# Altium schematic sheet USB Circuit.SchDoc
size A4
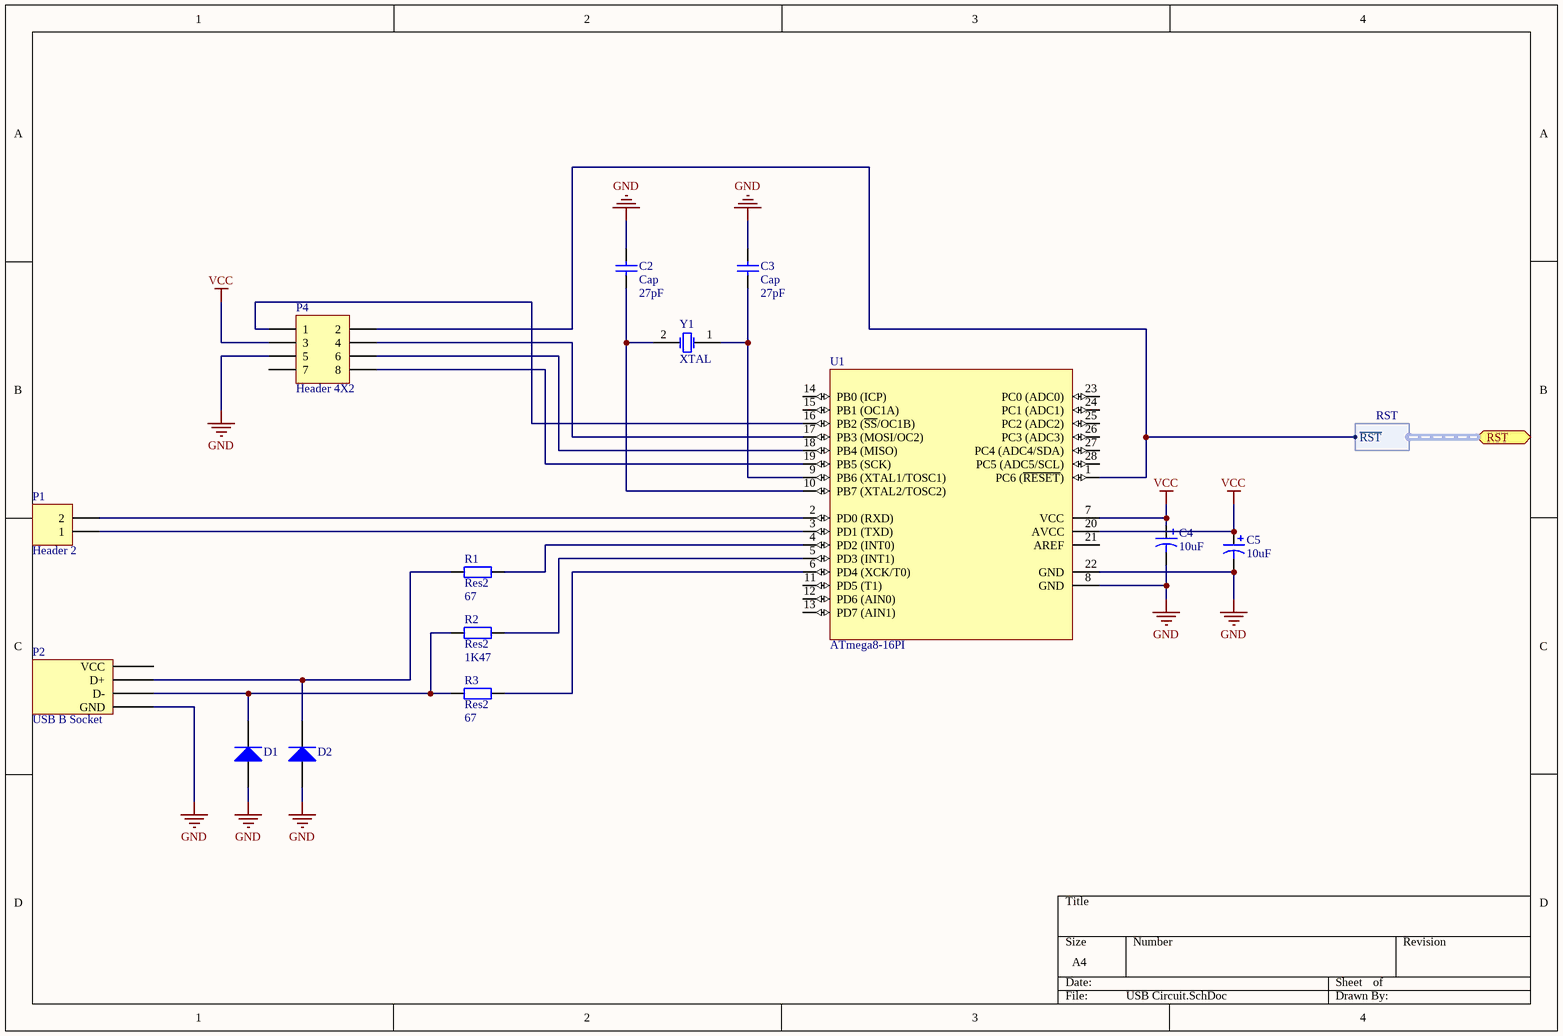
[diagram p0: USB Circuit.SchDoc]

## Parts
C2  Cap  value 27pF  [CAPR2.54-5.1x3.2]
C3  Cap  value 27pF  [CAPR2.54-5.1x3.2]
C4  value 10uF  [CAPPR1.5-4x5]  (hidden comment: Cap Pol1)
C5  value 10uF  [CAPPR1.5-4x5]  (hidden comment: Cap Pol1)
D1  BZX79-C3V6  [SOD27]  (value not drawn)
D2  BZX79-C3V6  [SOD27]  (value not drawn)
P1  Header 2  [HDR1X2]
P2  USB B Socket  [USB B Socket]
P4  Header 4X2  [HDR2X4]
R1  Res2  value 67  [AXIAL-0.4]
R2  Res2  value 1K47  [AXIAL-0.4]
R3  Res2  value 67  [AXIAL-0.4]
U1  ATmega8-16PI  [28P3]
Y1  XTAL  [Crystal Oscillator]

## Ports
RST (harness RST)

## Harnesses
RST: ~{RST}

## Nets
GND: C2.2 C3.2 C4.2 C5.2 D1.1(A) D2.1(A) P2.GND P4.5 U1.8(GND) U1.22(GND)
VCC: C4.1 C5.1 P4.3 U1.7(VCC) U1.20(AVCC)
NetC2_1: C2.1 U1.10(PB7_(XTAL2/TOSC2)) Y1.2(OSC2)
NetC3_1: C3.1 U1.9(PB6_(XTAL1/TOSC1)) Y1.1(OSC1)
NetD1_2: D1.2(K) P2.D- R2.2 R3.1
NetD2_2: D2.2(K) P2.D+ R1.1
NetP1_1: P1.1 U1.3(PD1_(TXD))
NetP1_2: P1.2 U1.2(PD0_(RXD))
NetP4_1: P4.1 U1.16(PB2_(~{SS}/OC1B))
NetP4_2: P4.2 U1.1(PC6_(~{RESET})) ; port RST.~{RST}
NetP4_4: P4.4 U1.17(PB3_(MOSI/OC2))
NetP4_6: P4.6 U1.18(PB4_(MISO))
NetP4_8: P4.8 U1.19(PB5_(SCK))
NetR1_2: R1.2 U1.4(PD2_(INT0))
NetR2_1: R2.1 U1.5(PD3_(INT1))
NetR3_2: R3.2 U1.6(PD4_(XCK/T0))

Not connected (* = marked no-connect by the designer): P2 VCC; P4 7; U1 11(PD5_(T1)) 12(PD6_(AIN0)) 13(PD7_(AIN1)) 14(PB0_(ICP)) 15(PB1_(OC1A)) 21(AREF) 23(PC0_(ADC0)) 24(PC1_(ADC1)) 25(PC2_(ADC2)) 26(PC3_(ADC3)) 27(PC4_(ADC4/SDA)) 28(PC5_(ADC5/SCL))

## Library data of the parts
C2 C3 = Cap: Capacitor; Published: 8-Jun-2000; LatestRevisionDate: 17-Jul-2002; LatestRevisionNote: Re-released for DXP Platform.; PackageReference: RAD-0.3; Publisher: Altium Limited
C4 C5 = Cap Pol1: Polarized Capacitor (Radial); Published: 8-Jun-2000; LatestRevisionDate: 17-Jul-2002; LatestRevisionNote: Re-released for DXP Platform.; PackageReference: RB7.6-15; Publisher: Altium Limited
D1 D2 = BZX79-C3V6: Voltage Regulator Diode; Code_IEC: A24; Published: 17-Sep-2003; DatasheetVersion: 27-Feb-2002; PackageVersion: Apr-1999; PackageReference: SOD27; Publisher: Altium Limited; PackageDescription: Diode, Axial; Body 4.3 x 1.9 mm (LxDia. max), Lead Dia. 0.56 mm (max); Code_JEITA: SC-40; Code_JEDEC: DO-35; ComponentLink1Description: Manufacturer Link; ComponentLink1URL: http://www.semiconductors.philips.com/; ComponentLink2Description: Datasheet; ComponentLink2URL: http://www.semiconductors.philips.com/acrobat/datasheets/BZX79_3.pdf
P1 = Header 2: Header, 2-Pin; LatestRevisionDate: 17-Jul-2002; LatestRevisionNote: Re-released for DXP Platform.; Publisher: Altium Limited
P4 = Header 4X2: Header, 4-Pin, Dual row; LatestRevisionDate: 17-Jul-2002; LatestRevisionNote: Re-released for DXP Platform.; Publisher: Altium Limited
R1-R3 = Res2: Resistor; Published: 8-Jun-2000; LatestRevisionDate: 17-Jul-2002; LatestRevisionNote: Re-released for DXP Platform.; PackageReference: AXIAL-0.4; Publisher: Altium Limited
U1 = ATmega8-16PI: 8-Bit AVR Microcontroller with 8K Bytes of In-System Programmable Flash Memory; Published: 17-Sep-2003; LatestRevisionDate: 04-Mar-2005; LatestRevisionNote: Stylized 3D Model Added.; DatasheetVersion: 2486H-AVR-09/02; PackageVersion: revB, Sep-2001; PackageReference: 28P3; Publisher: Altium Limited; PackageDescription: DIP; 28 Leads; Row Spacing 7.62 mm; Pitch 2.54 mm; ComponentLink1Description: Manufacturer Link; ComponentLink1URL: http://www.atmel.com; ComponentLink2Description: Datasheet; ComponentLink2URL: http://www.atmel.com/dyn/resources/prod_documents/doc2486.pdf
Y1 = Crystal Oscillator